# EAGLE design 20191118_GantryControl (EAGLE 9.5.1)
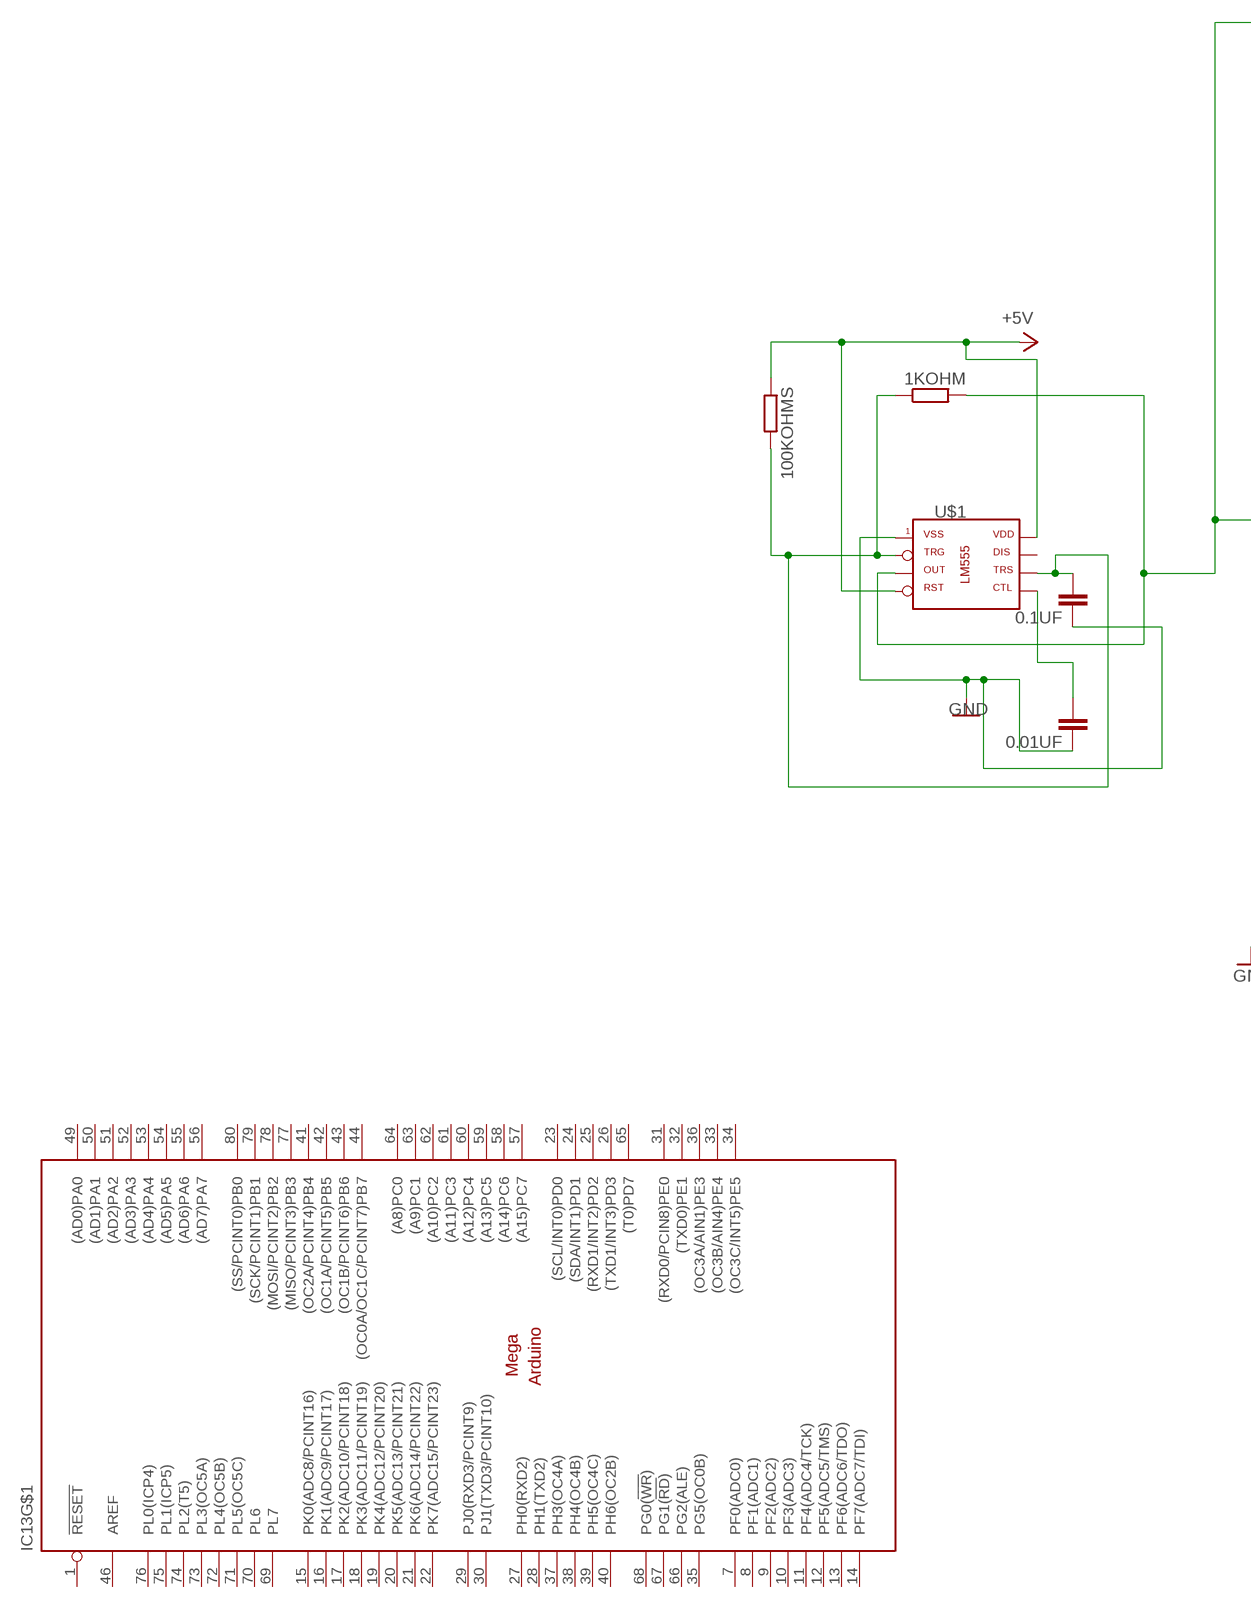
[diagram p0: schematic, sheet 1, part 1 of 2]
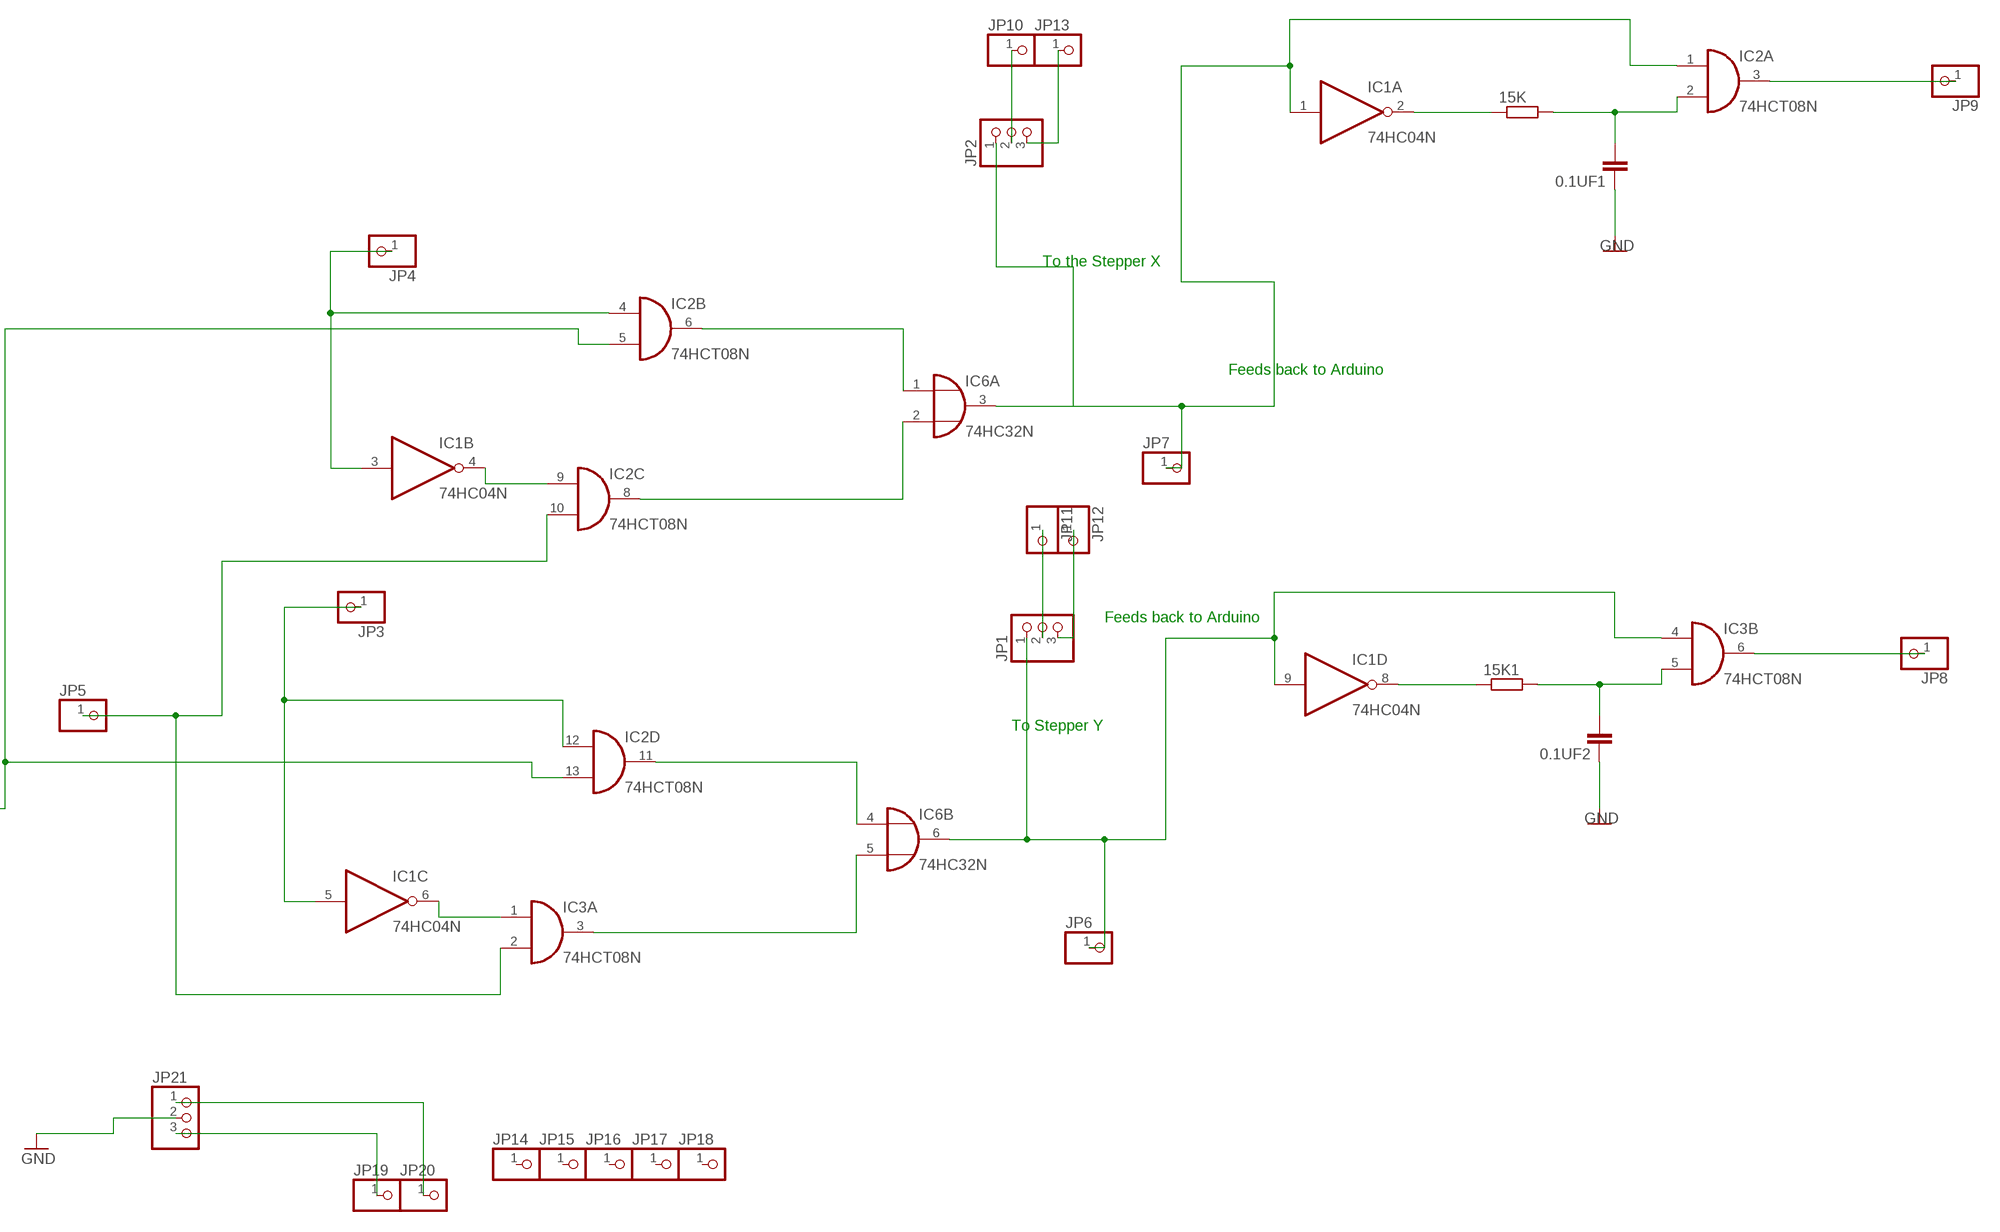
[diagram p1: schematic, sheet 1, part 2 of 2]

## Parts
0.01UF  C-EU102-064X133  [C102-064X133]
0.1UF  C-EU075-032X103  [C075-032X103]
0.1UF1  C-EU075-032X103  [C075-032X103]
0.1UF2  C-EU075-032X103  [C075-032X103]
1KOHM  R-EU_0207/12  [0207/12]
15K  R-EU_0207/10  [0207/10]
15K1  R-EU_0207/10  [0207/10]
100KOHMS  R-EU_0207/10  [0207/10]
IC1  74HC04N  [DIL14]
IC2  74HCT08N  [DIL14]
IC3  74HCT08N  [DIL14]
IC6  74HC32N  [DIL14]
IC13  MEGAARDUINO_20  [MEGA_ARDUINO]
JP1  PINHD-1X3  [1X03]
JP2  PINHD-1X3  [1X03]
JP3  PINHD-1X1  [1X01]
JP4  PINHD-1X1  [1X01]
JP5  PINHD-1X1  [1X01]
JP6  PINHD-1X1  [1X01]
JP7  PINHD-1X1  [1X01]
JP8  PINHD-1X1  [1X01]
JP9  PINHD-1X1  [1X01]
JP10  PINHD-1X1  [1X01]
JP11  PINHD-1X1  [1X01]
JP12  PINHD-1X1  [1X01]
JP13  PINHD-1X1  [1X01]
JP14  PINHD-1X1  [1X01]
JP15  PINHD-1X1  [1X01]
JP16  PINHD-1X1  [1X01]
JP17  PINHD-1X1  [1X01]
JP18  PINHD-1X1  [1X01]
JP19  PINHD-1X1  [1X01]
JP20  PINHD-1X1  [1X01]
JP21  PINHD-1X3  [1X03]
U$1  -LM555  [DIL08]

## Nets
+5V: 100KOHMS.1 U$1.4(RES) U$1.8(VCC)
GND: 0.1UF1.1 0.1UF2.1 0.1UF.1 0.01UF.1 JP21.2 U$1.1(GND)
N$1: 1KOHM.2 IC2.5(B:I1) IC2.13(D:I1) U$1.3(OUT)
N$2: 0.1UF.2 1KOHM.1 100KOHMS.2 U$1.2(TRG) U$1.6(TRS)
N$3: 0.01UF.2 U$1.5(CTL)
N$4: 15K.1 IC1.2(A:O)
N$5: IC1.1(A:I) IC2.1(A:I0) IC6.3(A:O) JP2.1 JP7.1
N$6: 0.1UF1.2 15K.2 IC2.2(A:I1)
N$7: IC3.6(B:O) JP8.1
N$8: IC1.3(B:I) IC2.4(B:I0) JP4.1
N$9: IC2.3(A:O) JP9.1
N$10: IC2.10(C:I1) IC3.2(A:I1) JP5.1
N$11: IC1.4(B:O) IC2.9(C:I0)
N$12: IC2.8(C:O) IC6.2(A:I1)
N$13: JP1.2 JP11.1
N$14: IC2.6(B:O) IC6.1(A:I0)
N$15: IC1.5(C:I) IC2.12(D:I0) JP3.1
N$16: JP1.3 JP12.1
N$17: JP2.2 JP10.1
N$18: IC1.6(C:O) IC3.1(A:I0)
N$19: IC3.3(A:O) IC6.5(B:I1)
N$20: IC2.11(D:O) IC6.4(B:I0)
N$21: IC1.9(D:I) IC3.4(B:I0) IC6.6(B:O) JP1.1 JP6.1
N$22: 15K1.1 IC1.8(D:O)
N$23: 0.1UF2.2 15K1.2 IC3.5(B:I1)
N$24: JP2.3 JP13.1
N$27: JP19.1 JP21.3
N$28: JP20.1 JP21.1
Unconnected: IC1.10(E:O) IC1.11(E:I) IC1.12(F:O) IC1.13(F:I) IC3.8(C:O) IC3.9(C:I0) IC3.10(C:I1) IC3.11(D:O) IC3.12(D:I0) IC3.13(D:I1) IC6.8(C:O) IC6.9(C:I0) IC6.10(C:I1) IC6.11(D:O) IC6.12(D:I0) IC6.13(D:I1) IC13.1(!RESET) IC13.7(PF0(ADC0)) IC13.8(PF1(ADC1)) IC13.9(PF2(ADC2)) IC13.10(PF3(ADC3)) IC13.11(PF4(ADC4/TCK)) IC13.12(PF5(ADC5/TMS)) IC13.13(PF6(ADC6/TDO)) IC13.14(PF7(ADC7/TDI)) IC13.15(PK0(ADC8/PCINT16)) IC13.16(PK1(ADC9/PCINT17)) IC13.17(PK2(ADC10/PCINT18)) IC13.18(PK3(ADC11/PCINT19)) IC13.19(PK4(ADC12/PCINT20)) IC13.20(PK5(ADC13/PCINT21)) IC13.21(PK6(ADC14/PCINT22)) IC13.22(PK7(ADC15/PCINT23)) IC13.23((SCL/INT0)PD0) IC13.24((SDA/INT1)PD1) IC13.25((RXD1/INT2)PD2) IC13.26((TXD1/INT3)PD3) IC13.27(PH0(RXD2)) IC13.28(PH1(TXD2)) IC13.29(PJ0(RXD3/PCINT9)) IC13.30(PJ1(TXD3/PCINT10)) IC13.31((RXD0/PCIN8)PE0) IC13.32((TXD0)PE1) IC13.33((OC3B/AIN4)PE4) IC13.34((OC3C/INT5)PE5) IC13.35(PG5(OC0B)) IC13.36((OC3A/AIN1)PE3) IC13.37(PH3(OC4A)) IC13.38(PH4(OC4B)) IC13.39(PH5(OC4C)) IC13.40(PH6(OC2B)) IC13.41((OC2A/PCINT4)PB4) IC13.42((OC1A/PCINT5)PB5) IC13.43((OC1B/PCINT6)PB6) IC13.44((OC0A/OC1C/PCINT7)PB7) IC13.46(AREF) IC13.49((AD0)PA0) IC13.50((AD1)PA1) IC13.51((AD2)PA2) IC13.52((AD3)PA3) IC13.53((AD4)PA4) IC13.54((AD5)PA5) IC13.55((AD6)PA6) IC13.56((AD7)PA7) IC13.57((A15)PC7) IC13.58((A14)PC6) IC13.59((A13)PC5) IC13.60((A12)PC4) IC13.61((A11)PC3) IC13.62((A10)PC2) IC13.63((A9)PC1) IC13.64((A8)PC0) IC13.65((T0)PD7) IC13.66(PG2(ALE)) IC13.67(PG1(!RD!)) IC13.68(PG0(!WR!)) IC13.69(PL7) IC13.70(PL6) IC13.71(PL5(OC5C)) IC13.72(PL4(OC5B)) IC13.73(PL3(OC5A)) IC13.74(PL2(T5)) IC13.75(PL1(ICP5)) IC13.76(PL0(ICP4)) IC13.77((MISO/PCINT3)PB3) IC13.78((MOSI/PCINT2)PB2) IC13.79((SCK/PCINT1)PB1) IC13.80((SS/PCINT0)PB0) JP14.1 JP15.1 JP16.1 JP17.1 JP18.1 U$1.7(DIS)

## Notes on the sheet
- To the Stepper X
- Feeds back to Arduino
- Feeds back to Arduino
- To Stepper Y

## Power pins joined to a net without a drawn wire
+3V3: IC13.2(+3V3)
+5V: IC13.3(+5V) IC13.47(+5V) IC13.48(+5V)
+VIN: IC13.6(+VIN)
GND: IC1.7(P:GND) IC2.7(P:GND) IC3.7(P:GND) IC6.7(P:GND) IC13.4(GND) IC13.5(GND) IC13.45(GND) IC13.81(GND) IC13.82(GND)
VCC: IC1.14(P:VCC) IC2.14(P:VCC) IC3.14(P:VCC) IC6.14(P:VCC)

## Library data of the parts
0.01UF 0.1UF 0.1UF1 0.1UF2 = rcl:C-EU: CAPACITOR, European symbol; SPICEPREFIX: C
1KOHM 15K 15K1 100KOHMS = rcl:R-EU_: RESISTOR, European symbol; SPICEPREFIX: R
IC1 = 74xx-eu:74*04: Hex INVERTER
IC2 IC3 = 74xx-eu:74*08: Quad 2-input AND gate
IC6 = 74xx-eu:74*32: Quad 2-input OR gate
IC13 = UoB_Mechatronics:MEGAARDUINO_2: The Arduino Mega is a microcontroller board based on the ATmega1280. - 54 digital input/output pins (of which 14 can be used as PWM outputs) - 16 analog inputs - 4 UARTs (hardware serial ports) - 16 MHz crystal oscillator - USB connection - power jack - ICSP header - reset button It contains everything needed to support the microcontroller; simply connect it to a computer with a USB cable or power it with a AC-to-DC adapter or battery to get started. The Mega is compatible with most shields designed for the Arduino Duemilanove or Diecimila. http://arduino.cc/en/Main/ArduinoBoardMega
JP1 JP2 JP21 = pinhead:PINHD-1X3: PIN HEADER
JP3-JP20 = pinhead:PINHD-1X1: PIN HEADER
U$1 = tango:-LM555

## Module LM555
Ports: 

### Library data of the parts

## Board
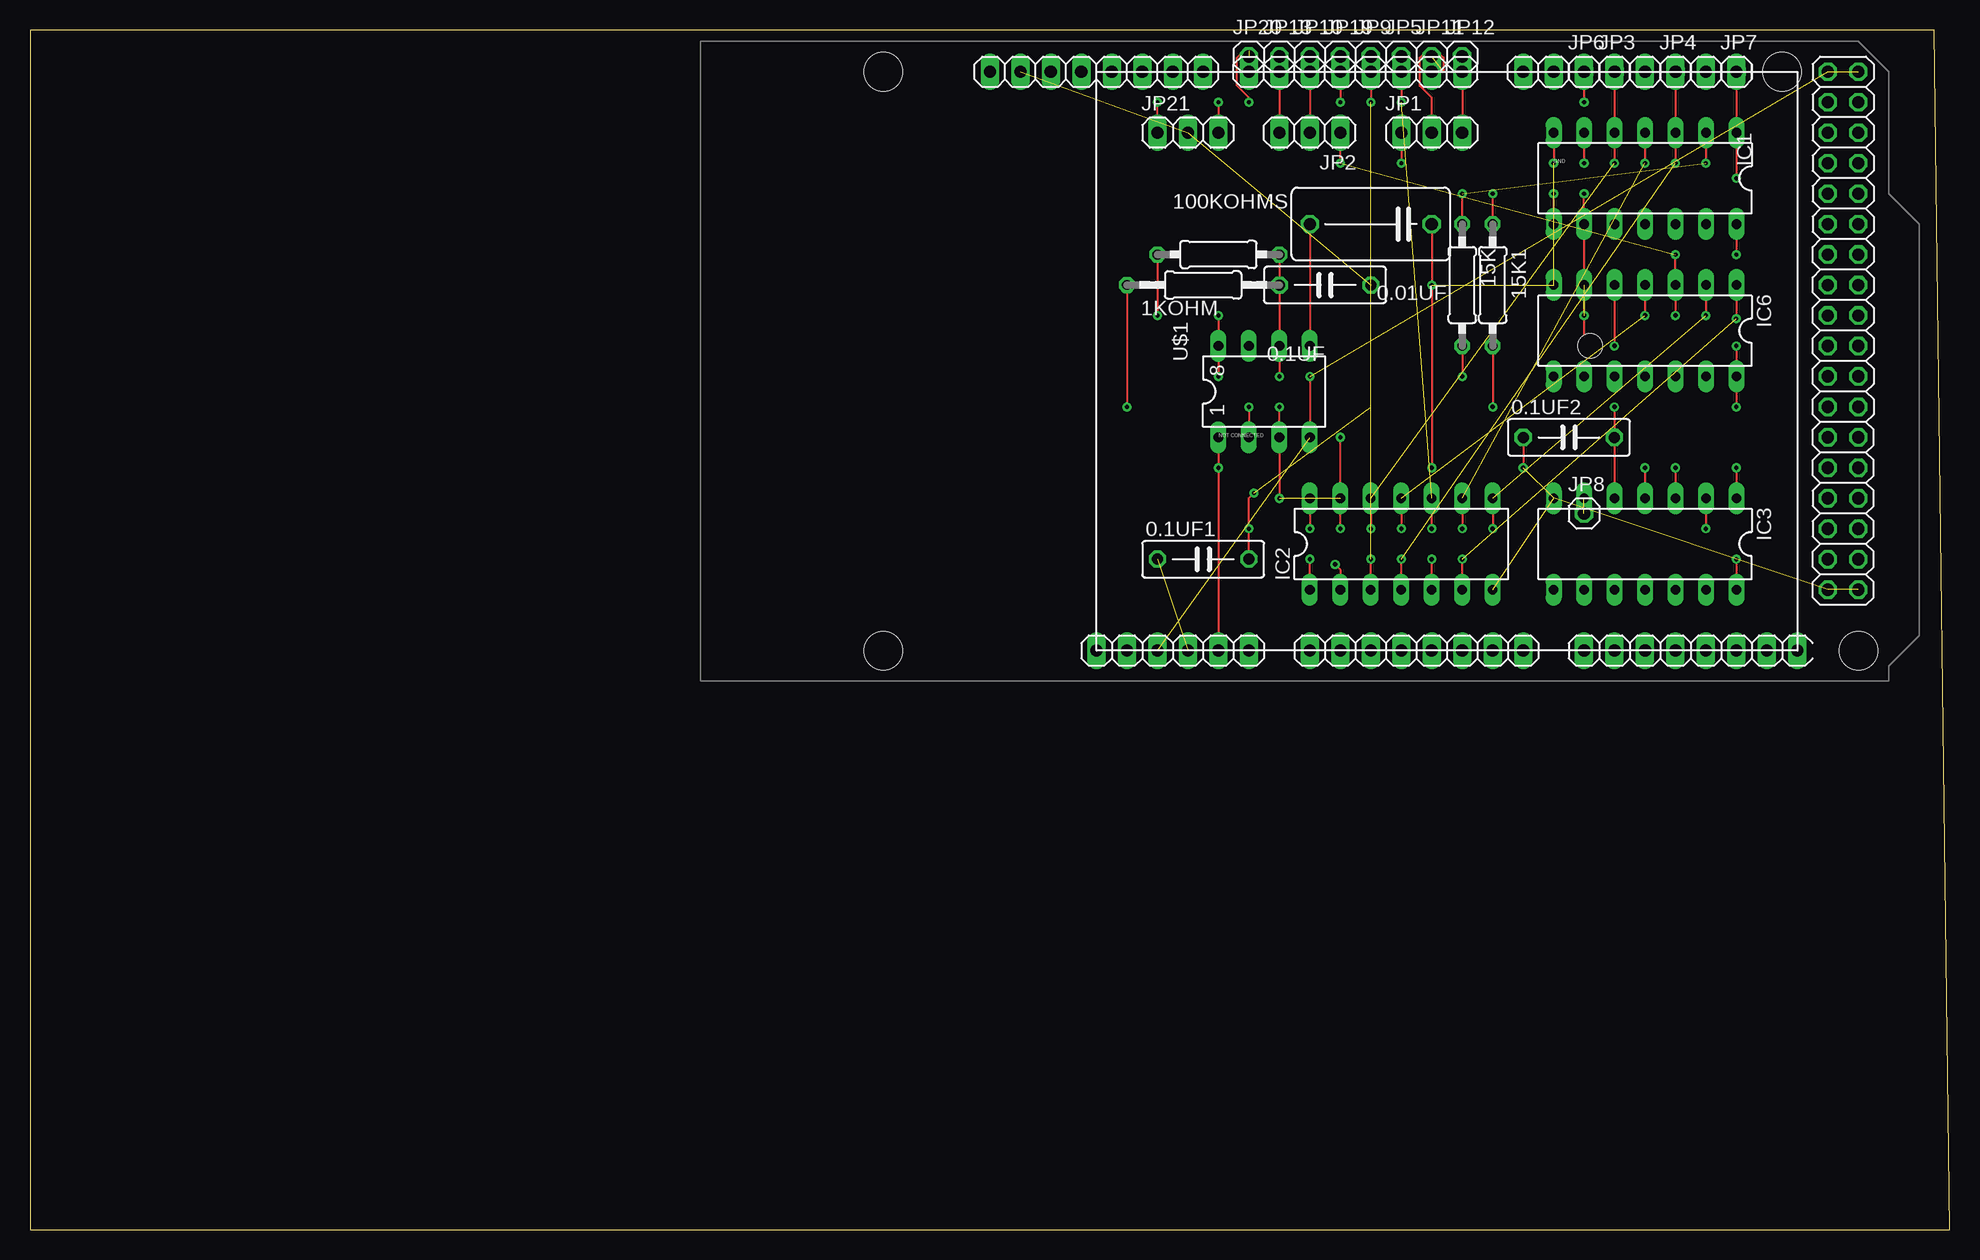
[diagram p2: board, top side]
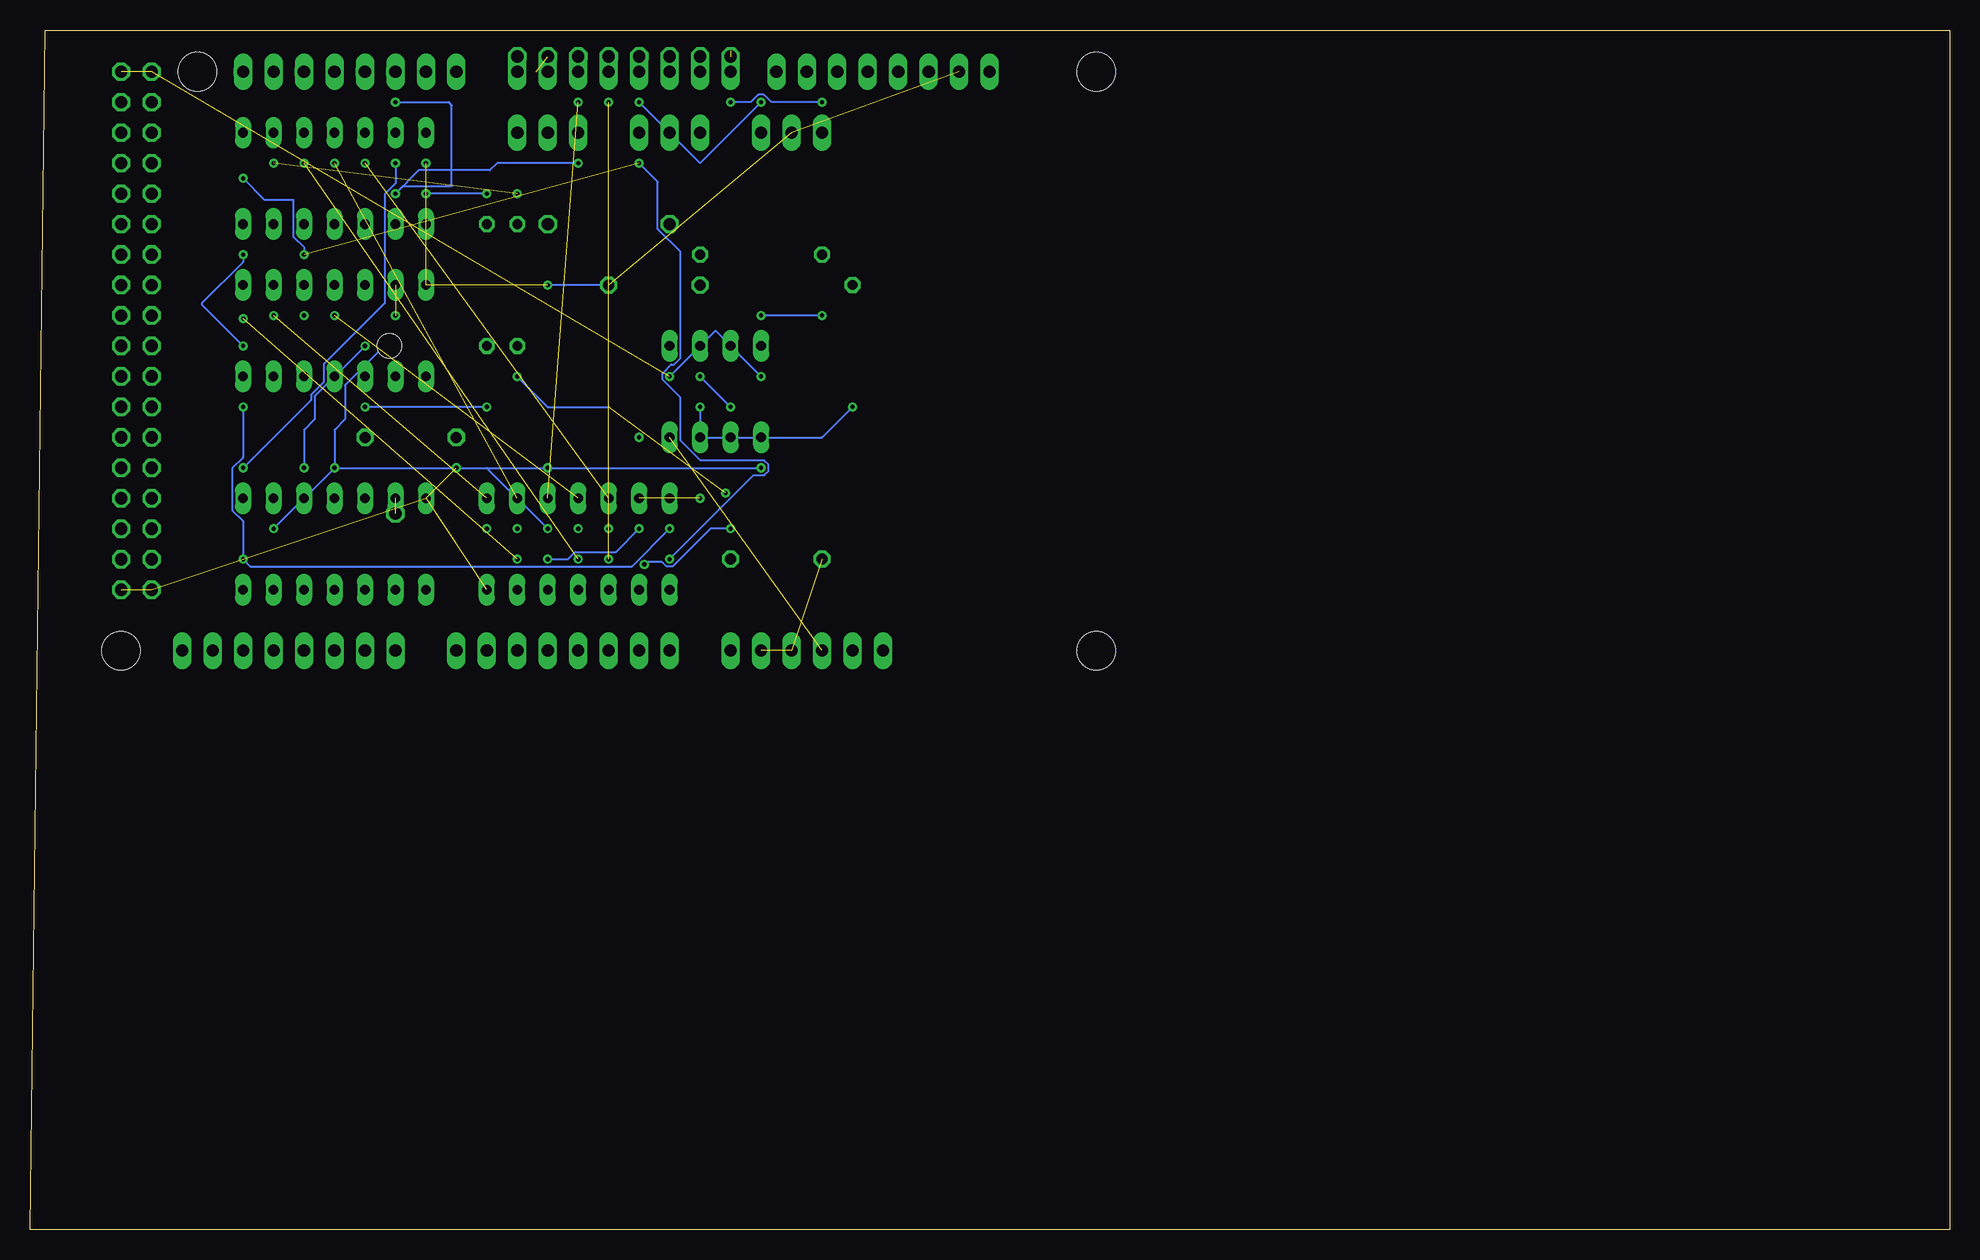
[diagram p3: board, bottom side, seen from below]

Size 160 x 100 mm. Coordinates in mm from the lower left corner, seen from the top.
Outline: 0,0 160,0 158.73,100 0,100 0,0
Copper layers (1*16): Top 0.035mm / dielectric 1.5mm / Bottom 0.035mm
Design rules "default": minimum track width 6mil, minimum drill 0.35mm, track to track 6mil, track to pad 6mil, pad to pad 6mil, via to via 6mil, smd to smd 6mil, copper to edge 40mil, drill to drill 6mil, minimum pad ring 10mil, minimum via ring 8mil, stop-mask expansion 4mil, vias tented up to drill 0mil, thermal gap 10mil

### Footprints (pad centres in the part's own frame; a part is rotated, then mirrored left to right if it is on the bottom)
C102-064X133 = drill 1.016 octagon: 1 -5.08,0; 2 5.08,0
C075-032X103 = drill 0.914 octagon: 1 -3.81,0; 2 3.81,0
0207/12 = drill 0.813 octagon: 1 -6.35,0; 2 6.35,0
0207/10 = drill 0.813 octagon: 1 -5.08,0; 2 5.08,0
DIL14 = drill 0.813 long: 1 -7.62,-3.81; 2 -5.08,-3.81; 3 -2.54,-3.81; 4 0,-3.81; 5 2.54,-3.81; 6 5.08,-3.81; 7 7.62,-3.81; 8 7.62,3.81; 9 5.08,3.81; 10 2.54,3.81; 11 0,3.81; 12 -2.54,3.81; 13 -5.08,3.81; 14 -7.62,3.81
MEGA_ARDUINO = drill 1.016 long: 1 33.02,2.54; 2 35.56,2.54; 3 38.1,2.54; 4 40.64,2.54; 5 43.18,2.54; 6 45.72,2.54; 7 50.8,2.54; 8 53.34,2.54; 9 55.88,2.54; 10 58.42,2.54; 11 60.96,2.54; 12 63.5,2.54; 13 66.04,2.54; 14 68.58,2.54; 15 73.66,2.54; 16 76.2,2.54; 17 78.74,2.54; 18 81.28,2.54; 19 83.82,2.54; 20 86.36,2.54; 21 88.9,2.54; 22 91.44,2.54; 23 86.36,50.8; 24 83.82,50.8; 25 81.28,50.8; 26 78.74,50.8; 27 76.2,50.8; 28 73.66,50.8; 29 71.12,50.8; 30 68.58,50.8; 31 63.5,50.8; 32 60.96,50.8; 33 58.42,50.8; 34 55.88,50.8; 35 53.34,50.8; 36 50.8,50.8; 37 48.26,50.8; 38 45.72,50.8; 39 41.91,50.8; 40 39.37,50.8; 41 36.83,50.8; 42 34.29,50.8; 43 31.75,50.8; 44 29.21,50.8; 45 26.67,50.8; 46 24.13,50.8 | drill 1.016 octagon: 47 93.98,50.8; 48 96.52,50.8; 49 93.98,48.26; 50 96.52,48.26; 51 93.98,45.72; 52 96.52,45.72; 53 93.98,43.18; 54 96.52,43.18; 55 93.98,40.64; 56 96.52,40.64; 57 93.98,38.1; 58 96.52,38.1; 59 93.98,35.56; 60 96.52,35.56; 61 93.98,33.02; 62 96.52,33.02; 63 93.98,30.48; 64 96.52,30.48; 65 93.98,27.94; 66 96.52,27.94; 67 93.98,25.4; 68 96.52,25.4; 69 93.98,22.86; 70 96.52,22.86; 71 93.98,20.32; 72 96.52,20.32; 73 93.98,17.78; 74 96.52,17.78; 75 93.98,15.24; 76 96.52,15.24; 77 93.98,12.7; 78 96.52,12.7; 79 93.98,10.16; 80 96.52,10.16; 81 93.98,7.62; 82 96.52,7.62 | hole 3.2: 15.24,50.8; 15.24,2.54; 90.17,50.8; 96.52,2.54 | hole 2: 74.168,27.94
1X03 = drill 1.016 long: 1 -2.54,0; 2 0,0; 3 2.54,0
1X01 = drill 1.016 octagon: 1 0,0
DIL08 = drill 0.813 long: 1 -3.81,-3.81; 2 -1.27,-3.81; 3 1.27,-3.81; 4 3.81,-3.81; 5 3.81,3.81; 6 1.27,3.81; 7 -1.27,3.81; 8 -3.81,3.81

### Placement (x,y rotation side)
0.01UF  111.76,83.82 180 top
0.1UF  107.95,78.74 180 top
0.1UF1  97.79,55.88 0 top
0.1UF2  128.27,66.04 0 top
1KOHM  97.79,78.74 180 top
15K  119.38,78.74 270 top
15K1  121.92,78.74 270 top
100KOHMS  99.06,81.28 0 top
IC1  134.62,87.63 180 top
IC2  114.3,57.15 0 top
IC3  134.62,57.15 180 top
IC6  134.62,74.93 180 top
IC13  55.88,45.72 0 top
JP1  116.84,91.44 0 top
JP2  106.68,91.44 180 top
JP3  132.08,96.52 0 top
JP4  137.16,96.52 0 top
JP5  114.3,97.79 0 top
JP6  129.54,96.52 0 top
JP7  142.24,96.52 0 top
JP8  129.54,59.69 0 top
JP9  111.76,97.79 0 top
JP10  106.68,97.79 0 top
JP11  116.84,97.79 0 top
JP12  119.38,97.79 0 top
JP13  104.14,97.79 0 top
JP14  -7.62,153.67 0 top  (outside the outline)
JP15  -7.62,148.59 0 top  (outside the outline)
JP16  -7.62,143.51 0 top  (outside the outline)
JP17  -7.62,138.43 0 top  (outside the outline)
JP18  -7.62,133.35 0 top  (outside the outline)
JP19  109.22,97.79 0 top
JP20  101.6,97.79 0 top
JP21  96.52,91.44 0 top
U$1  102.87,69.85 0 top

### Tracks (layer width: path | path; a pad name or v marks a point on that pad's centre or on a via)
+5V  (via drill 0.35)  (3 unrouted)
  Top 0.152: v99.06,71.12 U$1.8 v99.06,76.2 | v106.68,71.12 U$1.4 | 100KOHMS.1 v93.98,76.2
  Bottom 0.152: v106.68,71.12 102.87,74.93 v99.06,71.12 | v93.98,76.2 v99.06,76.2
GND  (via drill 0.35)  (10 unrouted)
  Top 0.152: 0.01UF.1 v116.84,78.74 v116.84,63.5 | U$1.1 v99.06,63.5 IC13.5 | 0.1UF2.1 v124.46,63.5 | IC1.7 v127,88.9
  Bottom 0.152: 0.1UF.1 v116.84,78.74 | v99.06,63.5 v116.84,63.5 v124.46,63.5
N$1  (via drill 0.35)  (1 unrouted)
  Top 0.152: 1KOHM.2 v91.44,68.58 | v104.14,68.58 U$1.3 v104.14,60.96 | IC2.5 v116.84,55.88 | v109.22,58.42 IC2.13 v109.22,66.04
  Bottom 0.152: v104.14,68.58 U$1.3 93.98,66.04 v91.44,68.58 | v116.84,55.88 115.16,55.88 114.55,56.49 111.15,56.49 v109.22,58.42
N$2  (via drill 0.35)
  Top 0.152: 100KOHMS.2 0.1UF.2 U$1.6 v104.14,71.12 | v101.6,68.58 U$1.2
  Bottom 0.152: v104.14,71.12 v101.6,68.58
N$3
  Top 0.152: 0.01UF.2 U$1.5
N$4  (via drill 0.35)  (1 unrouted)
  Top 0.152: 15K.1 v119.38,86.36 | IC1.2 v139.7,88.9
N$5  (via drill 0.35)  (1 unrouted)
  Top 0.152: JP7.1 IC1.1 v142.24,87.63 | v137.16,81.28 IC6.3 v137.16,76.2 | IC2.1 v106.68,55.88 | v109.22,88.9 JP2.1
  Bottom 0.152: v142.24,87.63 140.46,85.85 138.05,85.85 138.05,82.79 137.16,81.9 v137.16,81.28 | v109.22,88.9 107.67,87.35 107.67,83.41 105.79,81.53 105.79,72.63 106.31,72.11 106.55,72.11 107.29,71.37 107.29,70.87 105.79,69.37 105.79,65.77 104.12,64.11 98.81,64.11 98.45,63.75 98.45,63.25 98.81,62.89 99.67,62.89 v106.68,55.88
N$6  (via drill 0.35)  (1 unrouted)
  Top 0.152: 0.1UF1.2 v101.6,58.42 101.6,60.96 v102.03,61.39 | v108.79,55.45 109.22,55.02 IC2.2 | 15K.2 v119.38,71.12
  Bottom 0.152: v101.6,58.42 103.28,58.42 106.43,55.27 106.93,55.27 107.32,55.66 109,55.66 v108.79,55.45 | v119.38,71.12 116.84,68.58 111.76,68.58
N$7  (1 unrouted)
N$8  (via drill 0.35)  (1 unrouted)
  Top 0.152: JP4.1 IC1.3 v137.16,88.9 | IC2.4 v114.3,55.88
N$9  (via drill 0.35)  (1 unrouted)
  Top 0.152: JP9.1 v111.76,93.98 | IC2.3 v111.76,55.88
N$10  (via drill 0.35)  (1 unrouted)
  Top 0.152: IC3.2 v139.7,58.42 | v116.84,58.42 IC2.10 | JP5.1 v114.3,93.98
  Bottom 0.152: v139.7,58.42 134.62,63.5 121.92,63.5 v116.84,58.42
N$11  (via drill 0.35)  (1 unrouted)
  Top 0.152: IC1.4 v134.62,88.9 | IC2.9 v119.38,58.42
N$12  (via drill 0.35)  (1 unrouted)
  Top 0.152: IC6.2 v139.7,76.2 | IC2.8 v121.92,58.42
N$13  (1 unrouted)
  Top 0.152: JP1.2 116.84,94.36 115.85,95.35 115.85,97.69 116.43,98.27 117.25,98.27 117.83,97.69 117.83,96.52
N$14  (via drill 0.35)  (1 unrouted)
  Top 0.152: IC6.1 142.24,75.95 v142.21,75.95 | IC2.6 v119.38,55.88
N$15  (via drill 0.35)  (1 unrouted)
  Top 0.152: JP3.1 IC1.5 v132.08,88.9 | IC2.12 v111.76,58.42
  other vias: 132.08,91.44
N$16
  Top 0.152: JP12.1 JP1.3
N$17
  Top 0.152: JP10.1 JP2.2
N$18  (via drill 0.35)
  Top 0.152: IC1.6 v129.54,88.9 | v142.24,63.5 IC3.1
  Bottom 0.152: v142.24,63.5 136.58,69.16 136.58,69.59 135.51,70.66 135.51,72.15 130.43,77.23 130.43,86.33 129.54,87.22 v129.54,88.9
N$19  (via drill 0.35)
  Top 0.152: IC6.5 v132.08,73.66 | v137.16,63.5 IC3.3
  Bottom 0.152: v132.08,73.66 136.27,69.47 136.27,67.55 137.16,66.66 v137.16,63.5
N$20  (via drill 0.35)  (1 unrouted)
  Top 0.152: IC6.4 v134.62,76.2 | IC2.11 v114.3,58.42
N$21  (via drill 0.35)  (1 unrouted)
  Top 0.152: JP6.1 v129.54,93.98 | v129.54,86.36 IC1.9 IC6.6 v129.54,73.66 | v134.62,63.5 IC3.4 | JP1.1 v114.3,88.9
  Bottom 0.152: v129.54,93.98 125.12,93.98 124.84,93.7 124.84,86.98 128.92,86.98 v129.54,86.36 127.61,88.29 121.67,88.29 121.06,88.9 v114.3,88.9 | v129.54,73.66 129.99,73.21 130.91,73.21 133.73,70.4 133.73,67.55 134.62,66.66 v134.62,63.5
  other vias: 129.54,76.2 129.54,76.2
N$22  (via drill 0.35)
  Top 0.152: IC1.8 v127,86.36 | 15K1.1 v121.92,86.36
  Bottom 0.152: v121.92,86.36 v127,86.36
N$23  (via drill 0.35)
  Top 0.152: IC3.5 0.1UF2.2 v132.08,68.58 | 15K1.2 v121.92,68.58
  Bottom 0.152: v121.92,68.58 v132.08,68.58
N$24
  Top 0.152: JP13.1 JP2.3
N$27  (via drill 0.35)
  Top 0.152: JP19.1 v109.22,93.98 | v99.06,93.98 JP21.3
  Bottom 0.152: v109.22,93.98 104.14,88.9 v99.06,93.98
N$28  (via drill 0.35)  (1 unrouted)
  Top 0.152: JP21.1 v93.98,93.98 | 101.6,98.27 101.19,98.27 100.61,97.69 100.61,95.35 101.6,94.36 v101.6,93.98
  Bottom 0.152: v93.98,93.98 98.2,93.98 98.81,94.59 99.31,94.59 99.92,93.98 v101.6,93.98
VCC  (via drill 0.35)
  Top 0.152: v142.24,68.58 IC6.14 v142.24,73.66 | v142.24,55.88 IC3.14 | IC1.14 v142.24,81.28 | IC2.14 v106.68,58.42
  Bottom 0.152: v142.24,68.58 142.24,64.36 143.13,63.47 143.13,59.93 142.24,59.04 v142.24,55.88 141.63,55.27 109.83,55.27 v106.68,58.42 | v142.24,81.28 142.24,80.66 145.67,77.23 145.67,77.09 v142.24,73.66

### Text on the board
tPlace: GND | NOT CONNECTED